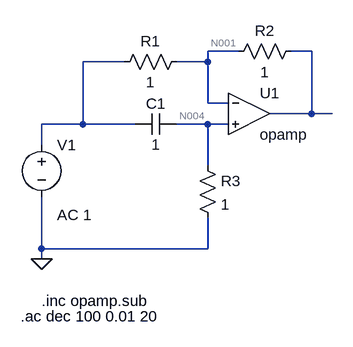
[diagram p0: schematic ej1_a.asc]
ej1_a.asc, the LTspice schematic file:
Version 4
SHEET 1 880 680
WIRE 608 16 560 16
WIRE 720 16 688 16
WIRE 432 32 368 32
WIRE 560 32 560 16
WIRE 560 32 512 32
WIRE 560 96 560 32
WIRE 592 96 560 96
WIRE 720 112 720 16
WIRE 720 112 656 112
WIRE 752 112 720 112
WIRE 368 128 368 32
WIRE 368 128 304 128
WIRE 448 128 368 128
WIRE 560 128 512 128
WIRE 592 128 560 128
WIRE 304 160 304 128
WIRE 560 192 560 128
WIRE 304 320 304 240
WIRE 560 320 560 272
WIRE 560 320 304 320
WIRE 304 336 304 320
FLAG 304 336 0
SYMBOL OpAmps\\opamp 624 48 R0
SYMATTR InstName U1
SYMBOL voltage 304 144 R0
WINDOW 123 24 124 Left 2
WINDOW 39 0 0 Left 0
SYMATTR Value2 AC 1
SYMATTR InstName V1
SYMATTR Value ""
SYMBOL cap 512 112 R90
WINDOW 0 0 32 VBottom 2
WINDOW 3 32 32 VTop 2
SYMATTR InstName C1
SYMATTR Value 1
SYMBOL res 528 16 R90
WINDOW 0 0 56 VBottom 2
WINDOW 3 32 56 VTop 2
SYMATTR InstName R1
SYMATTR Value 1
SYMBOL res 704 0 R90
WINDOW 0 0 56 VBottom 2
WINDOW 3 32 56 VTop 2
SYMATTR InstName R2
SYMATTR Value 1
SYMBOL res 544 176 R0
SYMATTR InstName R3
SYMATTR Value 1
TEXT 304 400 Left 2 !.inc opamp.sub
TEXT 272 424 Left 2 !.ac dec 100 0.01 20

The netlist it stands for:
* ej1_a.asc
XU1 N001 N004 N002 opamp Aol=100K GBW=10Meg  ; pins invin noninvin out
V1 N003 0 AC 1
C1 N004 N003 1
R1 N001 N003 1
R2 N002 N001 1
R3 N004 0 1
.inc opamp.sub
.ac dec 100 0.01 20
.backanno
.end

* Results of the author's LTspice run, read from the files saved beside the schematic
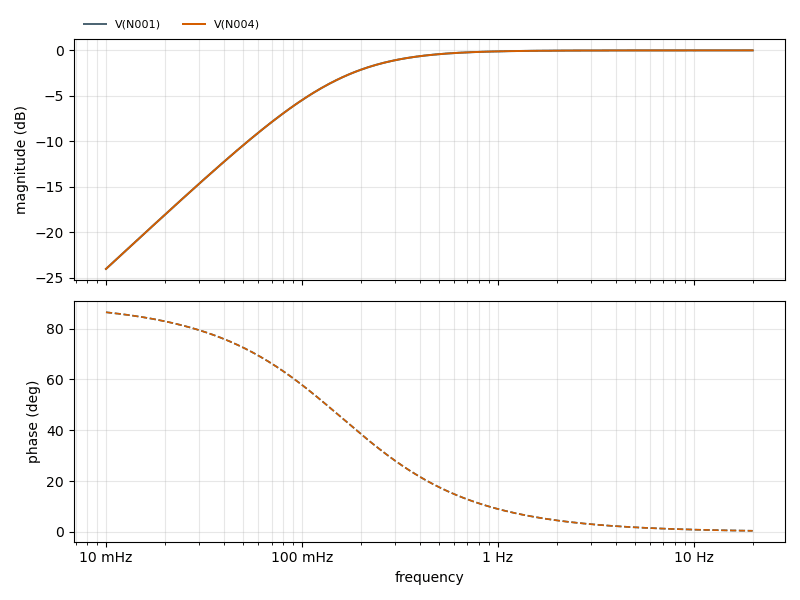
[diagram p1: AC Analysis of ej1_a.asc, plotted from the saved traces]
* AC Analysis, 1 run:
*   V(N001): -24.05 dB at 10 mHz, -0.00 dB at 20 Hz, peak -0.00 dB at 20 Hz, 3 dB below the peak at 159.2 mHz
*   V(N004): -24.05 dB at 10 mHz, -0.00 dB at 20 Hz, peak -0.00 dB at 20 Hz, 3 dB below the peak at 159.2 mHz